# EAGLE board LautIOProto2 (EAGLE 9.6.2), part 1 of 2
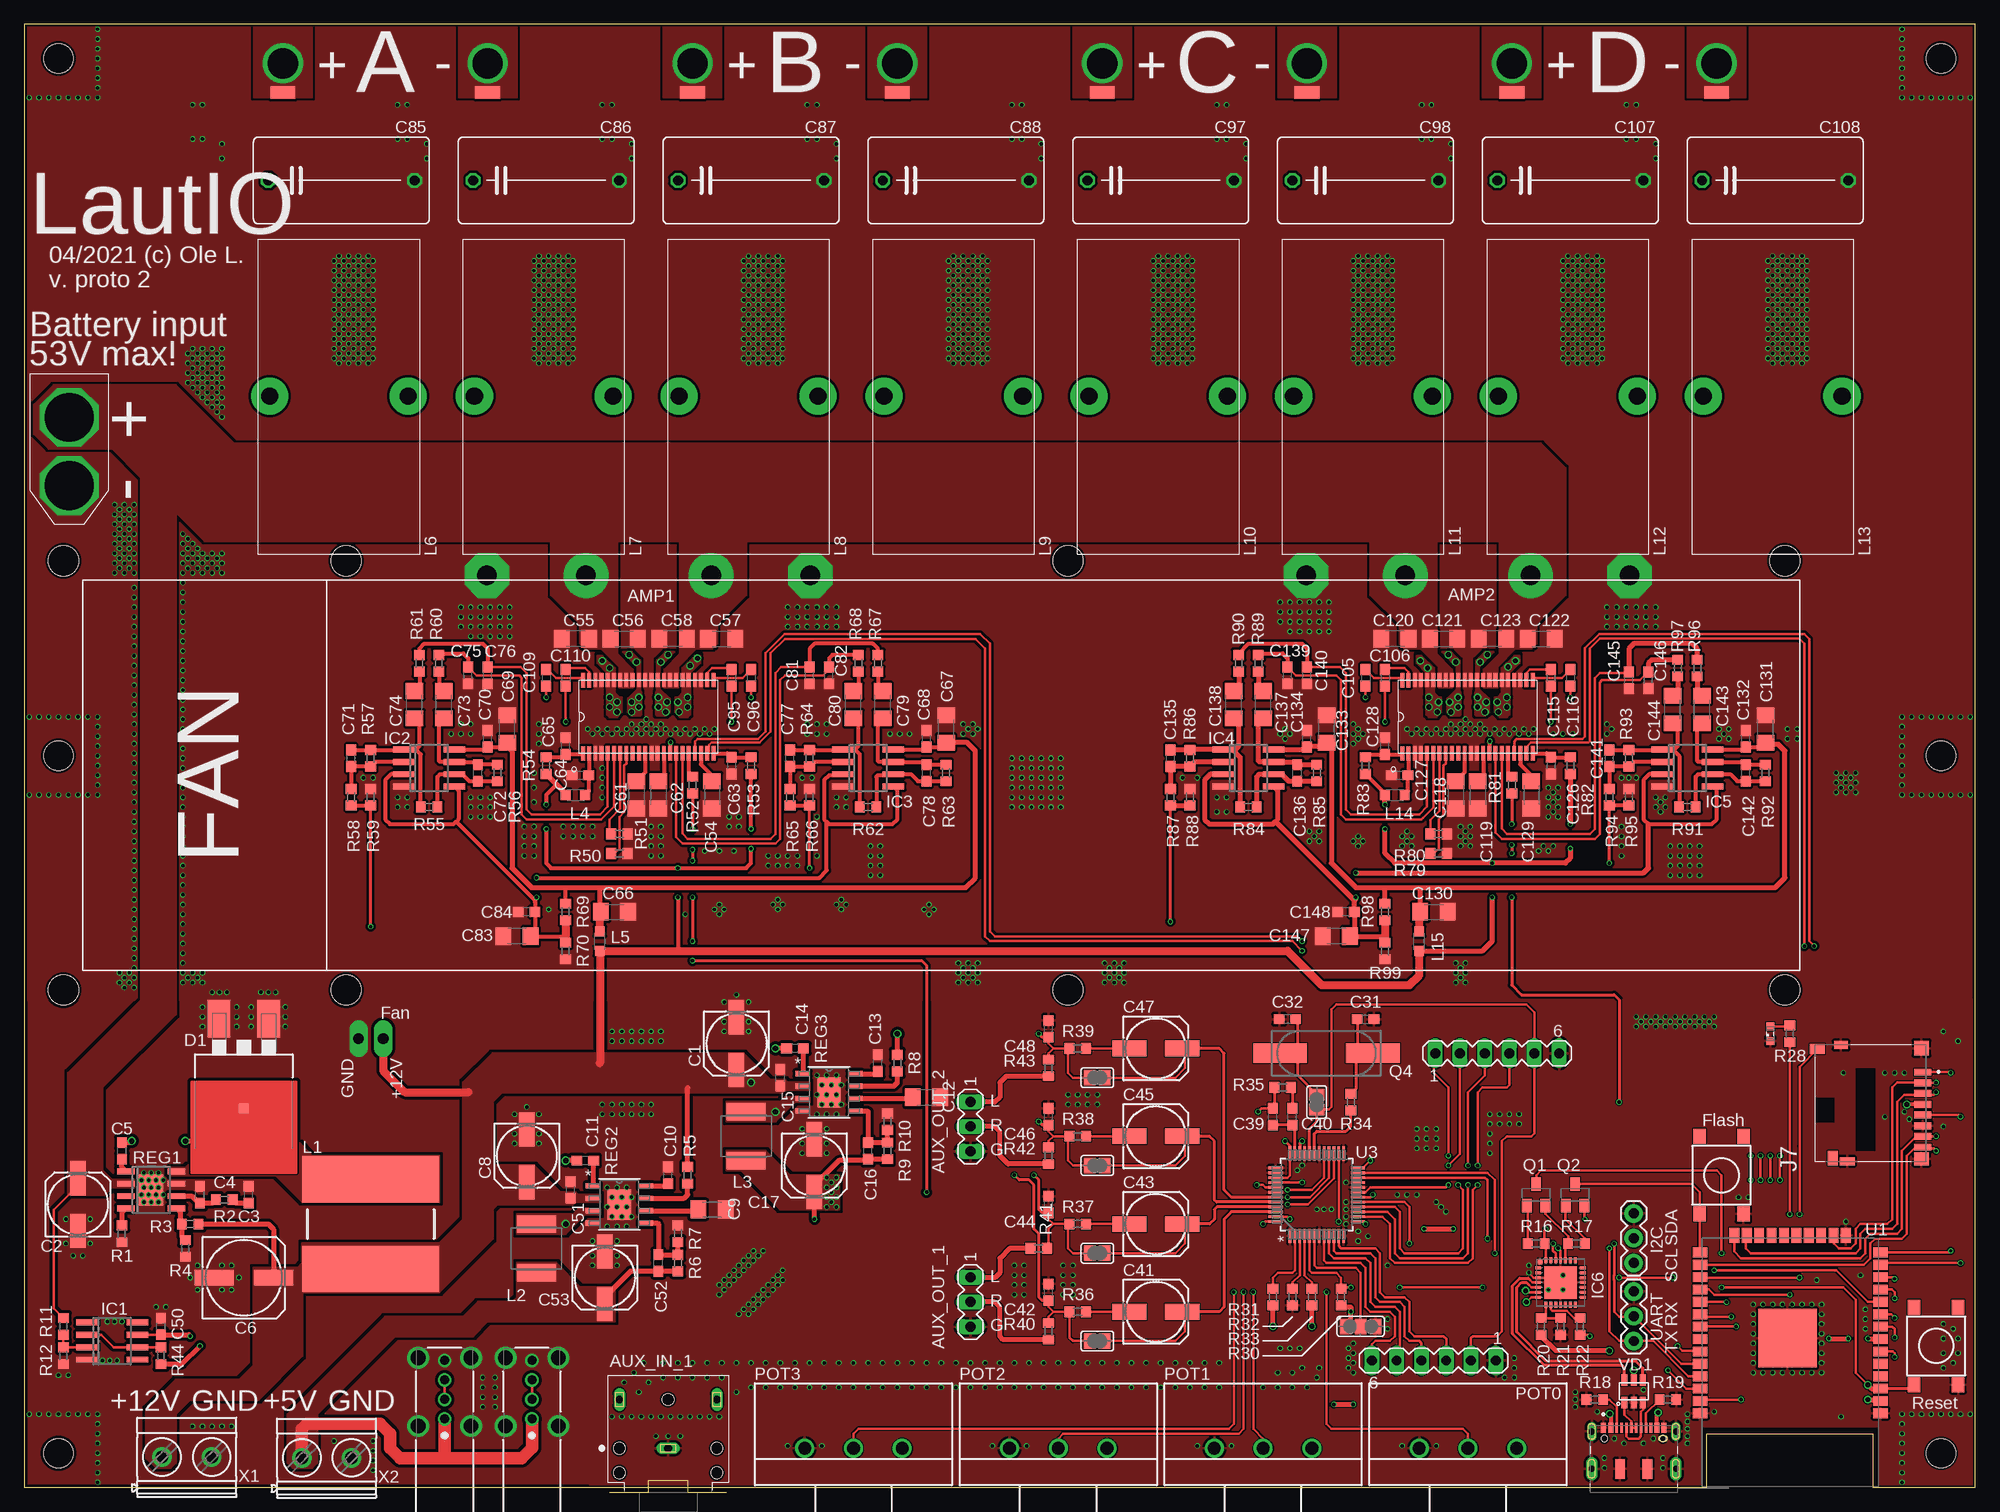
[diagram p8: board, top side]
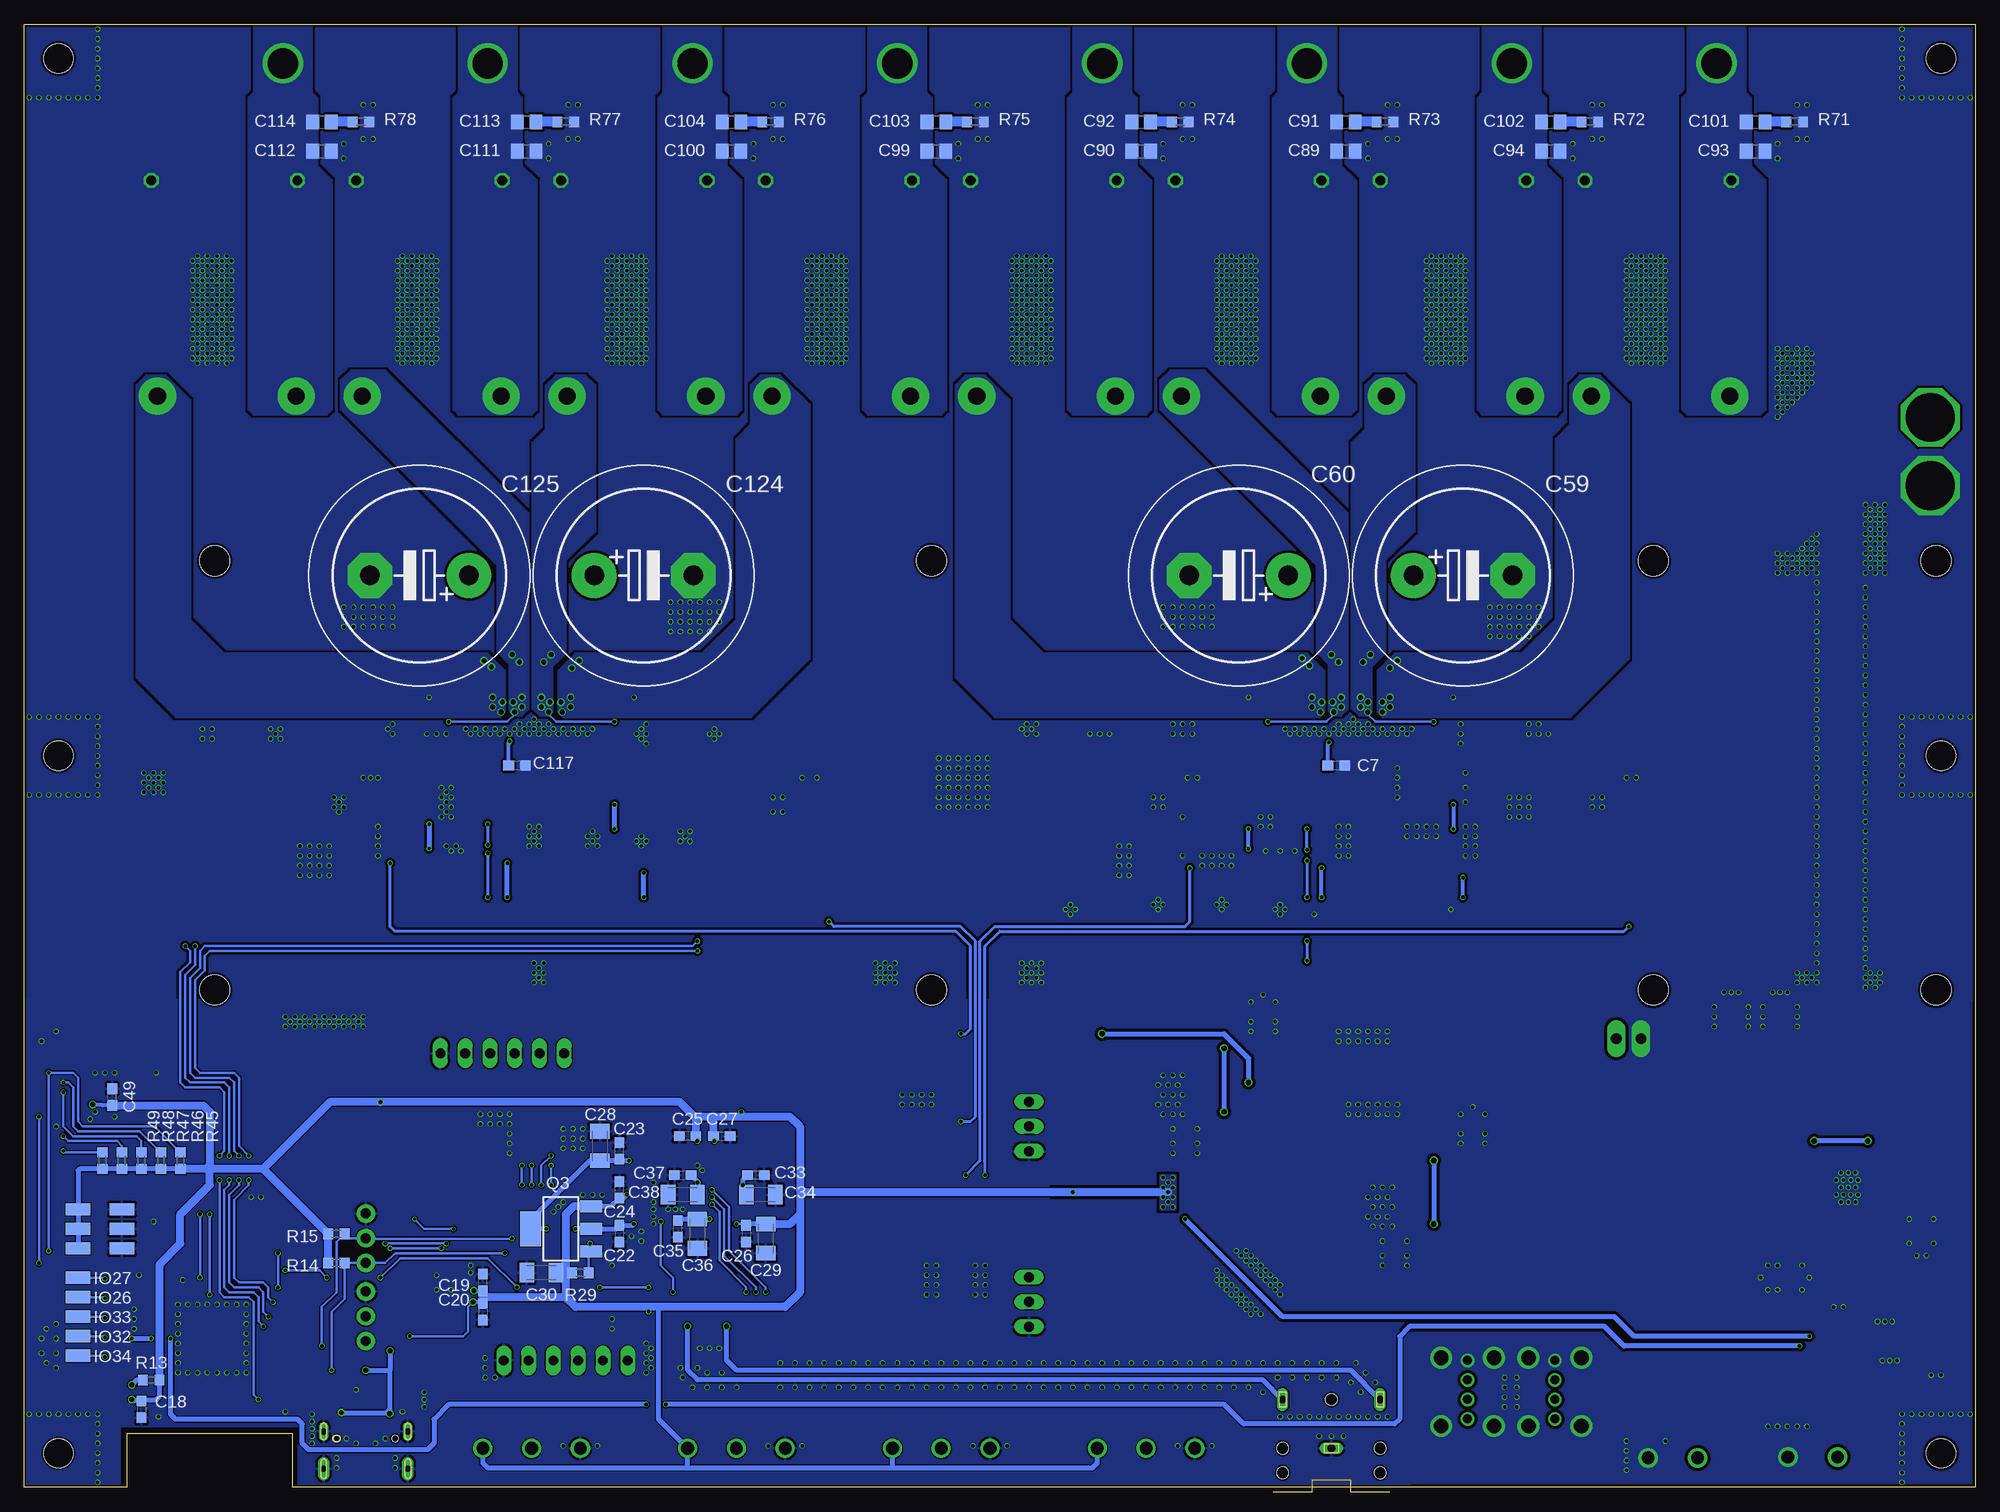
[diagram p9: board, bottom side, seen from below]

Size 200 x 150 mm. Coordinates in mm from the lower left corner, seen from the top.
Outline: 0,0 172.5,0 172.5,5.5 189.5,5.5 189.5,0 200,0 200,150 0,150 0,0
Copper layers (1*16): Top 0.035559375mm / dielectric 1.6mm / Bottom 0.035559375mm
Design rules "jlcpcb2layer *": minimum track width 5mil, minimum drill 12mil, track to track 5mil, track to pad 5mil, pad to pad 5mil, via to via 5mil, smd to smd 5mil, copper to edge 8mil, drill to drill 6mil, minimum pad ring 5mil, minimum via ring 3mil, stop-mask expansion 2.5mil, vias tented up to drill 0mil, thermal gap 10mil
Holes 3 mm at 196.5,3.5 196.5,146.5 3.5,146.5 3.5,3.5 196.5,75 3.5,75
Holes 3.1 mm at 4,95 180.5,95 180.5,51 4,51 107,95 107,51 33,51 33,95

## Footprints (pad centres in the part's own frame; a part is rotated, then mirrored left to right if it is on the bottom)
SMD1,27-2,54 = smd 1.27 x 2.54: 1 0,0
HTSSOP44 = smd 1.45 x 0.4: P$1 -3.75,-0.4; P$2 -3.75,-1.035; P$3 -3.74,-1.67; P$4 -3.74,-2.305; P$5 -3.74,-2.94; P$6 -3.74,-3.575; P$7 -3.74,-4.21; P$8 -3.74,-4.845; P$9 -3.74,-5.48; P$10 -3.74,-6.15; P$11 -3.74,-6.785; P$12 -3.74,-7.42; P$13 -3.74,-8.055; P$14 -3.74,-8.69; P$15 -3.74,-9.325; P$16 -3.74,-9.96; P$17 -3.74,-10.595; P$18 -3.74,-11.23; P$19 -3.74,-11.865; P$20 -3.74,-12.5; P$21 -3.74,-13.135; P$22 -3.74,-13.77; P$23 3.76,-13.77; P$24 3.76,-13.135; P$25 3.76,-12.5; P$26 3.76,-11.865; P$27 3.76,-11.23; P$28 3.76,-10.595; P$29 3.76,-9.96; P$30 3.76,-9.325; P$31 3.76,-8.69; P$32 3.76,-8.055; P$33 3.76,-7.42; P$34 3.76,-6.785; P$35 3.76,-6.15; P$36 3.76,-5.48; P$37 3.76,-4.845; P$38 3.76,-4.21; P$39 3.76,-3.575; P$40 3.76,-2.94; P$41 3.76,-2.305; P$42 3.76,-1.67; P$43 3.75,-1.035; P$44 3.75,-0.4
CUI_SJ1-3523N = drill 0.8 long: 1 0,0; 2 5,-5; 3 5,5 | hole 1.2: -2.5,5; 0,5; 5,0; -2.5,-5; 0,-5
MA03-1 = drill 1.016 long: 1 -2.54,0; 2 0,0; 3 2.54,0
153CLV-0605 = smd 3.5 x 1.6: + 2.7,0; - -2.7,0
C0603 = smd 1.1 x 1: 1 -0.85,0; 2 0.85,0
153CLV-0807 = smd 4 x 1.6: + 3.05,0; - -3.05,0
C3216 = smd 1.6 x 1.8: 1 -1.4,0; 2 1.4,0
C1206K = smd 1.5 x 2: 1 -1.5,0; 2 1.5,0
EB22,5D = drill 2.007 pad 4.597: + -5.08,0 | drill 2.007 pad 4.597 octagon: - 5.08,0
C150-091X182 = drill 1.016 octagon: 1 -7.493,0; 2 7.493,0
C0805 = smd 1.3 x 1.5: 1 -0.95,0; 2 0.95,0
MA06-1 = drill 1.016 long: 1 -6.35,0; 2 -3.81,0; 3 -1.27,0; 4 1.27,0; 5 3.81,0; 6 6.35,0
TO-263/D2PAK = smd 2.32 x 3.81: 1 -2.54,-7.045; 3 2.54,-7.045 | smd 1 x 1: 2 0,2.125
SO08 = smd 0.6 x 2.2: 1 -1.905,-2.6; 2 -0.635,-2.6; 3 0.635,-2.6; 4 1.905,-2.6; 5 1.905,2.6; 6 0.635,2.6; 7 -0.635,2.6; 8 -1.905,2.6
MLP28 = smd 0.6 x 0.3: 1 -2.3,1.5; 2 -2.3,1; 3 -2.3,0.5; 4 -2.3,0; 5 -2.3,-0.5; 6 -2.3,-1; 7 -2.3,-1.5; 15 2.3,-1.5; 16 2.3,-1; 17 2.3,-0.5; 18 2.3,0; 19 2.3,0.5; 20 2.3,1; 21 2.3,1.5 | smd 0.3 x 0.6: 8 -1.5,-2.3; 9 -1,-2.3; 10 -0.5,-2.3; 11 0,-2.3; 12 0.5,-2.3; 13 1,-2.3; 14 1.5,-2.3; 22 1.5,2.3; 23 1,2.3; 24 0.5,2.3; 25 0,2.3; 26 -0.5,2.3; 27 -1,2.3; 28 -1.5,2.3 | smd 3.3 x 3.3: EXP 0,0 | smd 0.435 x 0.435: M -2.103,2.103
614004134726 = drill 0.92: 1 0,2.41; 2 0,4.41; 3 0,6.41; 4 0,8.41 | drill 1.5: S1 -2.71,8.68; S2 2.71,8.68; S3 2.71,1.68; S4 -2.71,1.68
JAE_DX07S016JA1R1500 = smd 0.52 x 1: 1 -3.1,1.1; 2 -2.35,1.1; 11 2.35,1.1; 12 3.1,1.1 | smd 0.27 x 1: 3 -1.75,1.1; 4 -1.25,1.1; 5 -0.75,1.1; 6 -0.25,1.1; 7 0.25,1.1; 8 0.75,1.1; 9 1.25,1.1; 10 1.75,1.1 | smd 1 x 2: S1 -1.4,-3.1; S2 1.4,-3.1 | drill 0.65 long: S3 -4.32,0.725; S4 4.32,0.725 | drill 0.65 pad 1.2 long: S5 -4.32,-3.1; S6 4.32,-3.1 | hole 0.6: 3,0 | hole 0.63: 3,0; -3,0
1X03 = drill 1.016 pad 1.88: 1 0,0; 2 2.54,0; 3 5.08,0
1X02_LONGPADS = drill 1.118 pad 1.88 long: 1 0,0; 2 2.54,0
AMPHENOL_1140084168 = smd 0.7 x 1.75: 1 3.2,-0.875; 2 2.1,-0.875; 3 1,-0.875; 4 -0.1,-0.875; 5 -1.2,-0.875; 6 -2.3,-0.875; 7 -3.4,-0.875; 8 -4.5,-0.875 | smd 1 x 1.55: 9 5.575,9.925 | smd 1.45 x 1: 10 -5.625,8.35 | smd 1.5 x 1.5: S1 5.65,-0.75 | smd 1.3 x 1.5: S2 -5.7,-0.75 | smd 0.8 x 1.4: S3 5.975,7.5 | smd 0.8 x 1.5: S4 -5.95,6.85
INDUCTOR_SDR1307 = smd 14 x 4.75: P$1 0,4.6; P$2 0,-4.6
L5650M = smd 1.8 x 4: 1 -2.5,0; 2 2.5,0
L2012C = smd 1 x 1: 1 -1,0; 2 1,0
HCTI-10-20.0 = drill 1.75 pad 3.81: P$1 1.143,16.129; P$2 15.367,16.129
SML0603 = smd 0.8 x 0.8: A 0.75,0; C -0.75,0
CIP20C-6MM = drill 1.3 pad 1.93: A -5,0; E 5,0; S 0,0
SOT23-BEC = smd 1 x 1.4: B -0.95,-1.1; C 0,1.1; E 0.95,-1.1
SOT223 = smd 1.219 x 2.235: 1 -2.311,-3.099; 2 0,-3.099; 3 2.311,-3.099 | smd 3.6 x 2.2: 4 0,3.099
CSM-7X-DU = smd 5.5 x 2: 1 -4.75,0; 2 4.75,0
R0603 = smd 1 x 1.1: 1 -0.85,0; 2 0.85,0
HSOP8 = smd 0.6 x 1.8: 1 -1.905,-2.6; 2 -0.635,-2.6; 3 0.635,-2.6; 4 1.905,-2.6; 5 1.905,2.6; 6 0.635,2.6; 7 -0.635,2.6; 8 -1.905,2.6 | smd 3.2 x 2.51: EXP 0,0
DDA8_3P1X2P4_TEX = smd 1.455 x 0.533: 1 -2.721,1.905; 2 -2.721,0.635; 3 -2.721,-0.635; 4 -2.721,-1.905; 5 2.721,-1.905; 6 2.721,-0.635; 7 2.721,0.635; 8 2.721,1.905 | smd 2.4 x 3.1: EPAD 0,0
TACTILE_SWITCH_SMD_6.2MM_TALL = smd 1.55 x 1.3: A1 -3.975,-2.25; A2 3.975,-2.25; B1 -3.975,2.25; B2 3.975,2.25
SJ_2 = smd 1.168 x 1.6: 1 -1.524,0; 2 0,0; 3 1.524,0
SJ = smd 1.168 x 1.6: 1 -0.762,0; 2 0.762,0
ESP-WROOM-32 = smd 1.5 x 1: 1 -9.25,7; 2 -9.25,5.73; 3 -9.25,4.46; 4 -9.25,3.19; 5 -9.25,1.92; 6 -9.25,0.65; 7 -9.25,-0.62; 8 -9.25,-1.89; 9 -9.25,-3.16; 10 -9.25,-4.43; 11 -9.25,-5.7; 12 -9.25,-6.97; 13 -9.25,-8.24; 14 -9.25,-9.51; 25 9.25,-9.51; 26 9.25,-8.24; 27 9.25,-6.97; 28 9.25,-5.7; 29 9.25,-4.43; 30 9.25,-3.16; 31 9.25,-1.89; 32 9.25,-0.62; 33 9.25,0.65; 34 9.25,1.92; 35 9.25,3.19; 36 9.25,4.46; 37 9.25,5.73; 38 9.25,7 | smd 1 x 1.5: 15 -5.7,-11.25; 16 -4.43,-11.25; 17 -3.16,-11.25; 18 -1.89,-11.25; 19 -0.62,-11.25; 20 0.65,-11.25; 21 1.92,-11.25; 22 3.19,-11.25; 23 4.46,-11.25; 24 5.73,-11.25 | smd 6 x 6: GND 0.3,-0.7
ST_48_ADI = smd 1.462 x 0.279: 1 -4.216,2.75; 2 -4.216,2.25; 3 -4.216,1.75; 4 -4.216,1.25; 5 -4.216,0.75; 6 -4.216,0.25; 7 -4.216,-0.25; 8 -4.216,-0.75; 9 -4.216,-1.25; 10 -4.216,-1.75; 11 -4.216,-2.25; 12 -4.216,-2.75; 25 4.216,-2.75; 26 4.216,-2.25; 27 4.216,-1.75; 28 4.216,-1.25; 29 4.216,-0.75; 30 4.216,-0.25; 31 4.216,0.25; 32 4.216,0.75; 33 4.216,1.25; 34 4.216,1.75; 35 4.216,2.25; 36 4.216,2.75 | smd 0.279 x 1.462: 13 -2.75,-4.216; 14 -2.25,-4.216; 15 -1.75,-4.216; 16 -1.25,-4.216; 17 -0.75,-4.216; 18 -0.25,-4.216; 19 0.25,-4.216; 20 0.75,-4.216; 21 1.25,-4.216; 22 1.75,-4.216; 23 2.25,-4.216; 24 2.75,-4.216; 37 2.75,4.216; 38 2.25,4.216; 39 1.75,4.216; 40 1.25,4.216; 41 0.75,4.216; 42 0.25,4.216; 43 -0.25,4.216; 44 -0.75,4.216; 45 -1.25,4.216; 46 -1.75,4.216; 47 -2.25,4.216; 48 -2.75,4.216
XT60 = drill 5 octagon: + 4.5,0; - 11.5,0
SOT-23-6L = smd 0.6 x 1.2: 1 -0.95,-2.3; 2 0,-2.3; 3 0.95,-2.3; 4 0.95,0; 5 0,0; 6 -0.95,0
MKDSN1,5/2-5,08 = drill 1.3 pad 2: 1 -2.561,0.025; 2 2.519,0.025

## Placement (x,y rotation side)
3V3IO  [SMD1,27-2,54]  194.5,24.5 270 bottom
AMP1  TPA3255-Q1  [HTSSOP44]  56.87,79 90 top
AMP2  TPA3255-Q1  [HTSSOP44]  140.87,79 90 top
AUX_IN_1  SJ1-3523N  [CUI_SJ1-3523N]  66,4 90 top
AUX_OUT_1  [MA03-1]  97,19 270 top
AUX_OUT_2  [MA03-1]  97,37 270 top
C1  10µF  [153CLV-0605]  73,45.5 270 top
C2  10µF  [153CLV-0605]  5.5,29 90 top
C3  1.2nF  [C0603]  23,30 90 top
C4  6.8pF  [C0603]  18,30 90 top
C5  100nF  [C0603]  10,34.5 90 top
C6  47µF  [153CLV-0807]  22.5,21.5 0 top
C7  47nF  [C0603]  65.5,74 180 bottom
C8  10µF  [153CLV-0605]  51.5,34 270 top
C9  1µF  [C3216]  70.5,28.5 0 top
C10  8.2nF  [C0603]  66,32 90 top
C11  100nF  [C0603]  57.5,33.5 180 top
C12  1µF  [C3216]  92.5,40 0 top
C13  8.2nF  [C0603]  87.5,43.5 90 top
C14  100nF  [C0603]  79,45 180 top
C15  100nF  [C0603]  77.5,42 90 top
C16  10pF  [C0603]  86.5,34.5 90 top
C17  10µF  [153CLV-0605]  81,33 270 top
C18  100nF  [C0603]  188,8 270 bottom
C19  100nF  [C0603]  153,21 90 bottom
C20  100nF  [C0603]  153,18 270 bottom
C22  100n  [C0603]  139,26 270 bottom
C23  100n  [C0603]  139,34.5 90 bottom
C24  100n  [C0603]  139,30.5 90 bottom
C25  100n  [C0603]  132,36 180 bottom
C26  100n  [C0603]  126,26 270 bottom
C27  100n  [C0603]  128.5,36 0 bottom
C28  10µF  [C1206K]  141,35 90 bottom
C29  10µF  [C1206K]  124,25.5 270 bottom
C30  10µF  [C1206K]  147,22 180 bottom
C31  22pF  [C0603]  137.5,48 0 top
C32  22pF  [C0603]  129.5,48 180 top
C33  100n  [C0603]  125,32 180 bottom
C34  10µF  [C1206K]  124.5,30 180 bottom
C35  100n  [C0603]  133,26.5 90 bottom
C36  10µF  [C1206K]  131,26 90 bottom
C37  100n  [C0603]  132.5,32 0 bottom
C38  47µF  [C1206K]  132.5,30 0 bottom
C39  3.3nF  [C0603]  128,38 90 top
C40  56nF  [C0603]  130,38 90 top
C41  47µF  [153CLV-0605]  116,18 0 top
C42  5.6nF  [C0603]  105,20 90 top
C43  47µF  [153CLV-0605]  116,27 0 top
C44  5.6nF  [C0603]  105,29 90 top
C45  47µF  [153CLV-0605]  116,36 0 top
C46  5.6nF  [C0603]  105,38 90 top
C47  47µF  [153CLV-0605]  116,45 0 top
C48  5.6nF  [C0603]  105,47 90 top
C49  100nF  [C0603]  191,40 90 bottom
C50  100nF  [C0603]  14,16.5 90 top
C51  100nF  [C0603]  56,30.5 90 top
C52  10pF  [C0603]  65,23 90 top
C53  10µF  [153CLV-0605]  59.5,21.5 270 top
C54  1µF  [C3216]  70.5,71 270 top
C55  1µF  [C3216]  56.5,87 180 top
C56  1µF  [C3216]  61.5,87 0 top
C57  1µF  [C3216]  71.5,87 0 top
C58  1µF  [C3216]  66.5,87 180 top
C59  4700µF  [EB22,5D]  52.5,93.5 0 bottom
C60  4700µF  [EB22,5D]  75.5,93.5 180 bottom
C61  1µF  [C3216]  62.75,71 270 top
C62  1µF  [C3216]  65,71 270 top
C63  100nF  [C0603]  72.5,74 270 top
C64  100nF  [C0603]  57,73 180 top
C65  100nF  [C0603]  55.5,76 90 top
C66  1µF  [C3216]  60.5,59 0 top
C67  1µF  [C3216]  94.5,77.75 90 top
C68  100nF  [C0603]  92.5,76.75 90 top
C69  1µF  [C3216]  49.5,77.75 90 top
C70  100nF  [C0603]  47.5,76.75 90 top
C71  22pF  [C0603]  33.5,74.75 90 top
C72  22pF  [C0603]  46.5,73.25 90 top
C73  10µF  [C3216]  43,80.25 90 top
C74  10µF  [C3216]  40,80.25 90 top
C75  100nF  [C0603]  45.5,83.25 90 top
C76  100nF  [C0603]  47.5,83.25 90 top
C77  22pF  [C0603]  78.5,74.75 90 top
C78  22pF  [C0603]  92.5,73.25 90 top
C79  10µF  [C3216]  88,80.25 90 top
C80  10µF  [C3216]  85,80.25 90 top
C81  100nF  [C0603]  80.5,83.25 90 top
C82  100nF  [C0603]  82.5,83.25 90 top
C83  1µF  [C3216]  50.5,56.5 180 top
C84  100nF  [C0603]  51.5,59 180 top
C85  1µF  [C150-091X182]  32.5,134 0 top
C86  1µF  [C150-091X182]  53.5,134 0 top
C87  1µF  [C150-091X182]  74.5,134 0 top
C88  1µF  [C150-091X182]  95.5,134 0 top
C89  1000pF  [C0805]  64.5,137 0 bottom
C90  1000pF  [C0805]  85.5,137 0 bottom
C91  100nF  [C0805]  64.5,140 0 bottom
C92  100nF  [C0805]  85.5,140 0 bottom
C93  1000pF  [C0805]  22.5,137 0 bottom
C94  1000pF  [C0805]  43.5,137 0 bottom
C95  33nF  [C0603]  72.5,83 270 top
C96  33nF  [C0603]  74.5,83 270 top
C97  1µF  [C150-091X182]  116.5,134 0 top
C98  1µF  [C150-091X182]  137.5,134 0 top
C99  1000pF  [C0805]  106.5,137 0 bottom
C100  1000pF  [C0805]  127.5,137 0 bottom
C101  100nF  [C0805]  22.5,140 0 bottom
C102  100nF  [C0805]  43.5,140 0 bottom
C103  100nF  [C0805]  106.5,140 0 bottom
C104  100nF  [C0805]  127.5,140 0 bottom
C105  33nF  [C0603]  137.5,83 270 top
C106  33nF  [C0603]  139.5,83 270 top
C107  1µF  [C150-091X182]  158.5,134 0 top
C108  1µF  [C150-091X182]  179.5,134 0 top
C109  33nF  [C0603]  53.5,83 270 top
C110  33nF  [C0603]  55.5,83 270 top
C111  1000pF  [C0805]  148.5,137 0 bottom
C112  1000pF  [C0805]  169.5,137 0 bottom
C113  100nF  [C0805]  148.5,140 0 bottom
C114  100nF  [C0805]  169.5,140 0 bottom
C115  33nF  [C0603]  156.5,83 270 top
C116  33nF  [C0603]  158.5,83 270 top
C117  47nF  [C0603]  149.5,74 180 bottom
C118  1µF  [C3216]  146.75,71 270 top
C119  1µF  [C3216]  149,71 270 top
C120  1µF  [C3216]  140.5,87 180 top
C121  1µF  [C3216]  145.5,87 0 top
C122  1µF  [C3216]  155.5,87 0 top
C123  1µF  [C3216]  150.5,87 180 top
C124  4700µF  [EB22,5D]  136.5,93.5 0 bottom
C125  4700µF  [EB22,5D]  159.5,93.5 180 bottom
C126  100nF  [C0603]  156.5,74 270 top
C127  100nF  [C0603]  141,73 180 top
C128  100nF  [C0603]  139.5,76 90 top
C129  1µF  [C3216]  154.5,71 270 top
C130  1µF  [C3216]  144.5,59 0 top
C131  1µF  [C3216]  178.5,77.75 90 top
C132  100nF  [C0603]  176.5,76.75 90 top
C133  1µF  [C3216]  133.5,77.75 90 top
C134  100nF  [C0603]  131.5,76.75 90 top
C135  22pF  [C0603]  117.5,74.75 90 top
C136  22pF  [C0603]  130.5,73.25 90 top
C137  10µF  [C3216]  127,80.25 90 top
C138  10µF  [C3216]  124,80.25 90 top
C139  100nF  [C0603]  129.5,83.25 90 top
C140  100nF  [C0603]  131.5,83.25 90 top
C141  22pF  [C0603]  162.5,74.75 90 top
C142  22pF  [C0603]  176.5,73.25 90 top
C143  10µF  [C3216]  172,79.75 90 top
C144  10µF  [C3216]  169,79.75 90 top
C145  100nF  [C0603]  164.5,82.75 90 top
C146  100nF  [C0603]  166.5,82.75 90 top
C147  1µF  [C3216]  134.5,56.5 180 top
C148  100nF  [C0603]  135.5,59 180 top
CHAIN_INPUT  [MA06-1]  144.5,13 180 top
CHAIN_OUTPUT  [MA06-1]  151,44.5 0 top
D1  STPS20M100SG-TR  [TO-263/D2PAK]  22.5,41 180 top
IC1  UA741D  [SO08]  9,15 270 top
IC2  NE5532D  [SO08]  41.5,73.75 270 top
IC3  NE5532D  [SO08]  86.5,73.75 270 top
IC4  NE5532D  [SO08]  125.5,73.75 270 top
IC5  NE5532D  [SO08]  170.5,73.75 270 top
IC6  CP2102  [MLP28]  157.5,21 0 top
IO1  [SMD1,27-2,54]  190,24.5 270 bottom
IO2  [SMD1,27-2,54]  194.5,26.5 270 bottom
IO3  [SMD1,27-2,54]  194.5,28.5 270 bottom
IO4  [SMD1,27-2,54]  190,26.5 270 bottom
IO5  [SMD1,27-2,54]  190,28.5 90 bottom
IO26  [SMD1,27-2,54]  194.5,19.5 90 bottom
IO27  [SMD1,27-2,54]  194.5,21.5 90 bottom
IO32  [SMD1,27-2,54]  194.5,15.5 90 bottom
IO33  [SMD1,27-2,54]  194.5,17.5 90 bottom
IO34  [SMD1,27-2,54]  194.5,13.5 90 bottom
J1  614004134726  [614004134726]  52.04,4.6 0 top
J2  614004134726  [614004134726]  43.09,4.6 0 top
J3  DX07S016JA1R1500  [JAE_DX07S016JA1R1500]  165,5 0 top
J4  455-1750-1-ND  [1X03]  165,15 90 top
J5  455-1750-1-ND  [1X03]  165,23 90 top
J6  [1X02_LONGPADS]  34.25,46 0 top
J7  1140084168  [AMPHENOL_1140084168]  193.75,39.38 90 top
L1  15µH  [INDUCTOR_SDR1307]  35.5,27 0 top
L2  CLF7045T-3R3N  [L5650M]  52.5,24.5 270 top
L3  CLF7045T-3R3N  [L5650M]  74,36 270 top
L4  10µH  [L2012C]  56.5,71 0 top
L5  10µH  [L2012C]  59,56 90 top
L6  HTCI-10-20.0  [HCTI-10-20.0]  40.5,128 180 top
L7  HTCI-10-20.0  [HCTI-10-20.0]  61.5,128 180 top
L8  HTCI-10-20.0  [HCTI-10-20.0]  82.5,128 180 top
L9  HTCI-10-20.0  [HCTI-10-20.0]  103.5,128 180 top
L10  HTCI-10-20.0  [HCTI-10-20.0]  124.5,128 180 top
L11  HTCI-10-20.0  [HCTI-10-20.0]  145.5,128 180 top
L12  HTCI-10-20.0  [HCTI-10-20.0]  166.5,128 180 top
L13  HTCI-10-20.0  [HCTI-10-20.0]  187.5,128 180 top
L14  [L2012C]  140.5,71 0 top
L15  [L2012C]  143,56 90 top
LED_SYS  [SML0603]  179,46.5 90 top
PAD1  [SMD1,27-2,54]  26.5,143 270 top
PAD2  [SMD1,27-2,54]  47.5,143 270 top
PAD3  [SMD1,27-2,54]  89.5,143 270 top
PAD4  [SMD1,27-2,54]  68.5,143 270 top
PAD5  [SMD1,27-2,54]  110.5,143 270 top
PAD6  [SMD1,27-2,54]  131.5,143 270 top
PAD7  [SMD1,27-2,54]  173.5,143 270 top
PAD8  [SMD1,27-2,54]  152.5,143 270 top
POT0  [CIP20C-6MM]  148,4 0 top
POT1  [CIP20C-6MM]  127,4 0 top
POT2  [CIP20C-6MM]  106,4 0 top
POT3  [CIP20C-6MM]  85,4 0 top
Q1  SS8050-G  [SOT23-BEC]  155,30 0 top
Q2  SS8050-G  [SOT23-BEC]  159,30 0 top
Q3  ZX5T953  [SOT223]  145,26.5 90 bottom
Q4  12.288MHz  [CSM-7X-DU]  133.5,44.5 0 top
R1  187kΩ  [R0603]  10,26 90 top
R2  44.2kΩ  [R0603]  20.5,29.5 180 top
R3  147kΩ  [R0603]  17,27 0 top
R4  10.5kΩ  [R0603]  16.5,24.5 90 top
R5  10kΩ  [R0603]  68,32 270 top
R6  133kΩ  [R0603]  67,23 270 top
R7  24kΩ  [R0603]  67,26 270 top
R8  10kΩ  [R0603]  89.5,43.5 270 top
R9  84.5kΩ  [R0603]  88.5,34.5 270 top
R10  25.5kΩ  [R0603]  88.5,37.5 270 top
R11  1MΩ  [R0603]  4,16.5 90 top
R12  66.398kΩ  [R0603]  4,13.5 90 top
R13  10kΩ  [R0603]  187,11 0 bottom
R14  4.7kΩ  [R0603]  168,23 0 bottom
R15  4.7kΩ  [R0603]  168,26 0 bottom
R16  10kΩ  [R0603]  155,25 180 top
R17  10kΩ  [R0603]  159.12,25 0 top
R18  5.1kΩ  [R0603]  161,9 180 top
R19  5.1kΩ  [R0603]  168.5,9 0 top
R20  22.1kΩ  [R0603]  155.5,16.5 90 top
R21  47.5kΩ  [R0603]  157.5,16.5 270 top
R22  2kΩ  [R0603]  159.5,16.5 90 top
R28  47Ω  [R0603]  181,46.5 90 top
R29  1kΩ  [R0603]  143,22 180 bottom
R30  10kΩ  [R0603]  135,19.5 270 top
R31  18kΩ  [R0603]  128,19.5 270 top
R32  18kΩ  [R0603]  130,19.5 270 top
R33  18kΩ  [R0603]  132,19.5 270 top
R34  100Ω  [R0603]  136,39.5 90 top
R35  475Ω  [R0603]  129,41 0 top
R36  560Ω  [R0603]  108,18 0 top
R37  560Ω  [R0603]  108,27 0 top
R38  560Ω  [R0603]  108,36 0 top
R39  560Ω  [R0603]  108,45 0 top
R40  0Ω  [R0603]  105,16 270 top
R41  0Ω  [R0603]  104,24.5 180 top
R42  0Ω  [R0603]  105,34 270 top
R43  0Ω  [R0603]  105,43 270 top
R44  0kΩ  [R0603]  14,13.5 270 top
R45  47kΩ  [R0603]  184,33.5 90 bottom
R46  47kΩ  [R0603]  186,33.5 90 bottom
R47  47kΩ  [R0603]  188,33.5 90 bottom
R48  47kΩ  [R0603]  190,33.5 90 bottom
R49  47kΩ  [R0603]  192,33.5 90 bottom
R50  30kΩ  [R0603]  61,65 180 top
R51  22kΩ  [R0603]  61,67 180 top
R52  10kΩ  [R0603]  68.5,72 90 top
R53  0Ω  [R0603]  74.5,74 90 top
R54  0Ω  [R0603]  53.5,74 90 top
R55  10kΩ  [R0603]  41.5,69.75 0 top
R56  10kΩ  [R0603]  48.5,73.25 90 top
R57  10kΩ  [R0603]  35.5,74.75 90 top
R58  10kΩ  [R0603]  33.5,70.75 90 top
R59  100kΩ  [R0603]  35.5,70.75 270 top
R60  100Ω  [R0603]  42.5,84.5 90 top
R61  100Ω  [R0603]  40.5,84.5 90 top
R62  10kΩ  [R0603]  86.5,69.75 0 top
R63  10kΩ  [R0603]  94.5,73.25 90 top
R64  10kΩ  [R0603]  80.5,74.75 90 top
R65  10kΩ  [R0603]  78.5,70.75 90 top
R66  100kΩ  [R0603]  80.5,70.75 270 top
R67  100Ω  [R0603]  87.5,84.5 90 top
R68  100Ω  [R0603]  85.5,84.5 90 top
R69  10kΩ  [R0603]  55.5,59 270 top
R70  10kΩ  [R0603]  55.5,55 90 top
R71  3.3Ω  [R0603]  18.5,140 0 bottom
R72  3.3Ω  [R0603]  39.5,140 0 bottom
R73  3.3Ω  [R0603]  60.5,140 0 bottom
R74  3.3Ω  [R0603]  81.5,140 0 bottom
R75  3.3Ω  [R0603]  102.5,140 0 bottom
R76  3.3Ω  [R0603]  123.5,140 0 bottom
R77  3.3Ω  [R0603]  144.5,140 0 bottom
R78  3.3Ω  [R0603]  165.5,140 0 bottom
R79  30kΩ  [R0603]  145,65 180 top
R80  22kΩ  [R0603]  145,67 180 top
R81  10kΩ  [R0603]  152.5,72 90 top
R82  0Ω  [R0603]  158.5,74 90 top
R83  0Ω  [R0603]  137.5,74 90 top
R84  10kΩ  [R0603]  125.5,69.75 0 top
R85  10kΩ  [R0603]  132.5,73.25 90 top
R86  10kΩ  [R0603]  119.5,74.75 90 top
R87  10kΩ  [R0603]  117.5,70.75 90 top
R88  100kΩ  [R0603]  119.5,70.75 270 top
R89  100Ω  [R0603]  126.5,84.5 90 top
R90  100Ω  [R0603]  124.5,84.5 90 top
R91  10kΩ  [R0603]  170.5,69.75 0 top
R92  10kΩ  [R0603]  178.5,73.25 90 top
R93  10kΩ  [R0603]  164.5,74.75 90 top
R94  10kΩ  [R0603]  162.5,70.75 90 top
R95  100kΩ  [R0603]  164.5,70.75 270 top
R96  100Ω  [R0603]  171.5,84 90 top
R97  100Ω  [R0603]  169.5,84 90 top
R98  10kΩ  [R0603]  139.5,59 270 top
R99  10kΩ  [R0603]  139.5,55 90 top
REG1  TPS54560B-Q1  [HSOP8]  13,30.5 270 top
REG2  TPS54339DDA  [DDA8_3P1X2P4_TEX]  61,29 0 top
REG3  TPS54339DDA  [DDA8_3P1X2P4_TEX]  82.5,40.5 0 top
S1  MOMENTARY-SWITCH-SPST-SMD-6.2MM-TALL  [TACTILE_SWITCH_SMD_6.2MM_TALL]  196,14.5 270 top
S2  MOMENTARY-SWITCH-SPST-SMD-6.2MM-TALL  [TACTILE_SWITCH_SMD_6.2MM_TALL]  174,32 270 top
SJ1  [SJ_2]  137,16.5 180 top
SJ2  [SJ]  132.5,39.5 270 top
SJ6  [SJ]  110,15 180 top
SJ7  [SJ]  110,24 180 top
SJ8  [SJ]  110,33 180 top
SJ9  [SJ]  110,42 180 top
U1  ESP-WROOM-32  [ESP-WROOM-32]  181.05,14.58 180 top
U3  ADAU1701JSTZ  [ST_48_ADI]  132.5,30 90 top
U$1  XT60  [XT60]  4.59,114.21 270 top
VD1  [SOT-23-6L]  165,11 0 top
X1  MKDSN1,5/2-5,08  [MKDSN1,5/2-5,08]  16.68,3.08 0 top
X2  MKDSN1,5/2-5,08  [MKDSN1,5/2-5,08]  31,3 0 top

## Tracks (layer width: path | path; a pad name or v marks a point on that pad's centre or on a via)
+3V3  (via drill 0.35, 0.5)
  Top 0.254: IC1.7 13.98,15.63 C50.1 | v127,27 127.25,27.25 U3.48 | U3.39 129.5,31.75 129.75,32 U3.36 | R22.1 160.35,15.65 v160.5,15.5 | C39.2 126.85,38.85 v126.5,38.5 | U3.18 138,29.75 v138.25,30 | v153.91,20.16 154.07,20 IC6.6 | v154,19 154.5,19.5 IC6.7
  Top 0.305: R35.1 128.15,39 C39.2 | v129.25,35.5 129.75,35 U3.36 | v131,35.5 130.75,35.25 U3.34 | R52.1 v68.5,67.5 | v68.5,65.38 v68.5,64.25 | v68.5,60.5 v68.5,56 | v68.5,54 92,54 92.5,53.5 v92.5,30.25 | R81.1 v152.5,68 | v152.5,65.88 v152.5,65 | v152.5,60.5 152.5,51.5 153.5,50.5 163,50.5 163.5,50 v163.5,39.5
  Top 0.406: J7.4 193.03,39.27 v193,39.25
  Top 0.508: R9.2 C16.1 86.35,33.5 83.5,33.5 81,31 C17.+ v81,27.5 | v189,9 190.15,9 U1.2 | SJ1.3 135.98,17 135.98,17.98 v136,18 136,18.5 135.15,18.5 R30.2 | C50.1 16.85,15.65 v17,15.5
  Bottom 0.254: C26.1 126.15,27 v127,27 | v160.5,15.5 155,15.5 154.5,16 154.5,18.5 v154,19 | v126.5,38.5 126.5,38 | 152.5,66 v152.5,65.88 | v68.5,65.38 68.5,65.5
  Bottom 0.305: C27.1 129.35,35.6 v129.25,35.5 | C25.1 131.15,35.65 v131,35.5 | 68.5,65.5 v68.5,67.5 | v68.5,64.25 v68.5,60.5 | v68.5,56 v68.5,54 | v152.5,68 152.5,66 | v152.5,65 v152.5,60.5
  Bottom 0.406: v153.91,20.16 153.01,20.16 C19.1 | v154,19 153,19 | v193,39.25 192.1,39.25 192,39.15 C49.1
  Bottom 0.508: C19.1 153,19.5 153,19 C20.1 | v189,9 188.85,8.85 C18.1 187.85,9 186.5,9 186.15,9.35 R13.2 | R45.1 R46.1 R47.1 R48.1 R49.1 194.35,32.65 194.5,32.5 IO3.1 IO2.1 3V3IO.1 | C29.1 125.85,27 C26.1 | v138.25,30 138.6,29.65 C24.1 139.84,28.81 Q3.3 | v136,18 136,18.5 | POT0.E 153,2.5 152.5,2 132,2 | 132,2 POT1.E 135,7 135,18.5 | 132,2 111,2 | 111,2 POT2.E | 111,2 90.5,2 90,2.5 POT3.E | v17,15.5 35,15.5 37,17.5 71,17.5 v81,27.5
  Bottom 0.813: R29.2 144.5,22 | 144.5,22 C30.1 | Q3.3 143.69,28.81 144.5,28 144.5,22 | C49.1 181.65,39.15 181,38.5 181,33 | 181,33 181.35,32.65 | 181.35,32.65 R45.1 | R14.1 R15.1 175.5,32.65 | 175.5,32.65 181.35,32.65 | R13.2 186.15,22.85 184,25 184,28 181,31 181,33 | C27.1 129.35,37.85 129.5,38 | 129.5,38 131,38 131.15,37.85 | C25.1 131.15,37.85 | C29.1 121.5,27 120.5,28 | 120.5,30.5 120.5,37 121.5,38 126.5,38 129.5,38 | 120.5,30.5 120.5,28 | 120.5,28 120.5,20 122,18.5 135,18.5 136,18.5 143.5,18.5 144.5,19.5 | 144.5,22 144.5,19.5 | 131.15,37.85 132.8,39.5 v163.5,39.5 168.65,39.5 175.5,32.65 | 144.5,19.5 153,19.5 | v82.75,30.25 v92.5,30.25 120.25,30.25 120.5,30.5
  other vias: 82.75,31.25 82.75,29.25 82.25,29.75 82.25,30.75 83.25,30.75 82.25,31.75 83.25,31.75 83.25,29.75 83.25,28.75 82.25,28.75
  pour Top (rank 4, no thermals): 72,34.5 72,32.5 73.5,32.5 77.5,28.5 83.5,28.5 83.5,32 78.5,32 76,34.5
  pour Bottom (rank 4, no thermals): 83.5,32 82,32 82,28.5 83.5,28.5
+5V
  Top 0.508: R6.2 C52.1 62.15,22.15 59.5,19.5 C53.+
  Top 1.27: X2.1 28.44,5.94 29,6.5 36.5,6.5 37.5,5.5 37.5,4 38.5,3 43,3 | J1.1 52.04,4.04 51,3 43,3 | J2.1 43.09,3.09 43,3
  pour Top (rank 4, no thermals): 50.5,23 54.5,23 57,20.5 60.5,20.5 60.5,17 50.5,17
  pour Top (rank 4, no thermals): 50.5,17 47.5,17 46,15.5 38,15.5 30,7.5 30,2.5 29.5,2 27.5,2 27,2.5 27,7.5 37,17.5 45,17.5 46.5,19 50,19 50.5,19.5
+12V  (via drill 0.35, 0.55)
  Top 0.406: 54.58,72.08 53.5,71 v53.5,70 | v53.5,67.5 53.5,64 54,63.5 v67,63.5 74,63.5 74.5,64 v74.5,65.48 | v74.5,67.5 R53.1 | v67,60.5 67,55 | R83.1 139.5,71.15 L14.1
  Top 0.508: R3.2 25,27 25.55,26.45 C6.+ | R8.1 v89.5,46.5 | R5.1 68,41 | R54.1 54.58,72.08 55.5,71.15 L4.1 | R82.1 v158.5,68 | v158.5,65.5 158.5,64.5 158,64 v150.5,64 140.5,64 139.5,65 v139.5,67.5 | v139.5,70 L14.1 | L15.1 149.5,55 150.5,56 v150.5,60.5
  Top 0.813: 59,43.5 L5.1 67,55 129.5,55 133,51.5 142,51.5 143,52.5 L15.1 | J6.2 36.79,42.71 39,40.5 45.5,40.5
  Bottom 0.406: v53.5,70 v53.5,67.5 | v74.5,65.48 v74.5,67.5 | v67,60.5 v67,63.5
  Bottom 0.508: v89.5,46.5 77,46.5 74.5,44 v74.5,41.5 | v158.5,68 v158.5,65.5 | v139.5,67.5 v139.5,70 | v150.5,60.5 v150.5,64
  pour Top (rank 4, no thermals): 42.5,25 42.5,20 28.5,20 28,20.5 23.5,20.5 23.5,22.5 27.5,22.5 28,22.5 28.5,23 28.5,25
  pour Top (rank 4, no thermals): 59,30 59,29.25 56.5,29.25 56.25,29 50.75,29 50.75,33 52.25,33 55,30.25 56.5,30.25 56.75,30
  pour Top (rank 4, no thermals): 80.5,41.5 80.5,40.75 78,40.75 77.75,40.5 72.25,40.5 72.25,44.5 73.75,44.5 76.5,41.75 78,41.75 78.25,41.5
  pour Top (rank 4, no thermals): 12.5,3 13.5,2 15,2 15.5,2.5 15.5,7.5 17,9 24,9 28.5,13.5 28.5,20 28,20.5 23.5,20.5 23.5,12.5 22,11 15.5,11 12.5,8
  pour Top (rank 4, no thermals): 42.5,20 48,25.5 48,28.5 48.5,29 50.75,29 50.75,33 45,33 45,27.5 42.5,25
  pour Top (rank 4, no thermals): 45,33 45,41.5 48,44.5 72.25,44.5 72.25,40.5 49,40.5 48,39.5 48,33
+12VOA
  Top 0.406: IC3.8 92.25,75.66 C68.1 93.9,75.9 94.35,76.35 C67.1 | IC2.8 47.26,75.66 | C70.1 49.05,75.9 | 58.9,59 59,58.9 | R69.1 55.5,61.5
  Top 0.508: 47.26,75.66 C70.1 | 49.05,75.9 C69.1 49.5,76 50,75.5 50,63.5 52,61.5 55.5,61.5 59,61.5 | C66.1 59,59 59,61.5 | C67.1 96.65,76.35 97.5,75.5 97.5,62.5 96.5,61.5 59,61.5
  Top 0.813: L5.2 59,58.9 C66.1
+12VOA1
  Top 0.406: IC5.8 176.25,75.66 C132.1 178.05,75.9 178.32,76.17 C131.1
  Top 0.508: IC4.8 131.25,75.66 C134.1 131.6,76 133.5,76 C133.1 134,75.85 134,64 136.5,61.5 139.5,61.5 | R98.1 139.5,61.5 | 139.5,61.5 143,61.5 | 143,61.5 143.1,61.4 C130.1 | 178.32,76.17 179.82,76.17 180.5,75.5 180.5,62.5 179.5,61.5 143,61.5
  Top 0.813: C130.1 143,58.9 L15.2
A_LINE_A  (via drill 0.35)
  Top 0.254: SJ6.2 107.5,15 107.15,15.35 R36.1 105.5,18 | 105.5,18 105,18.5 C42.1 | 105.5,18 105,17.5 R40.1
  Top 0.305: C42.1 104.35,19.15 104,19.5 104,26 103.5,26.5 103.5,31 103,31.5 102,31.5 v101.5,32 | v35.5,57.5 R59.2
  Top 0.406: R58.1 R59.2
  Bottom 0.305: v101.5,32 101.5,55.5 100,57 36,57 v35.5,57.5
A_LINE_B  (via drill 0.35)
  Top 0.254: SJ7.2 107.5,24 107,24.5 107,26.85 R37.1 105.5,27 | 105.5,27 105,27.5 C44.1 | 105.5,27 105,26.5 105,24.65 R41.1
  Top 0.305: C44.1 104.35,28.15 104,28.5 104,31.5 v103.5,32 | v80.5,63.5 R66.2
  Top 0.406: R65.1 R66.2
  Bottom 0.305: v103.5,32 102,33.5 102,56 100.5,57.5 81,57.5 80.5,58 v80.5,63.5
A_LINE_C  (via drill 0.35)
  Top 0.254: SJ8.2 107.5,33 107,33.5 107,35.85 R38.1 105.5,36 | 105.5,36 105,35.5 R42.1 | C46.1 105,36.5 105.5,36
  Top 0.305: C46.1 104.35,37.15 v104,37.5 | v117.5,58 R87.1
  Top 0.508: R87.1 R88.2
  Bottom 0.305: v104,37.5 103,37.5 102.5,38 102.5,56 104,57.5 117,57.5 v117.5,58
A_LINE_D  (via drill 0.35)
  Top 0.254: SJ9.2 107.5,42 107,42.5 107,44.85 R39.1 105.5,45 | 105.5,45 105,44.5 R43.1 | C48.1 105,45.5 105.5,45
  Top 0.305: C48.1 104.35,46.15 v104,46.5 | v162.5,64 R94.1
  Top 0.406: R95.2 R94.1
  Bottom 0.305: v104,46.5 103.5,46.5 103,47 103,55.5 104.5,57 162,57 162.5,57.5 v162.5,64
AMP1_BST_A
  Top 0.254: C109.1 53.65,83.85 54.5,83 57.02,83 AMP1.P$44
AMP1_BST_B
  Top 0.254: AMP1.P$43 57.91,83.59 57.5,84 55.65,84 C110.1
AMP1_BST_C
  Top 0.254: AMP1.P$24 70.01,83.51 70.5,84 72.35,84 C95.1
AMP1_BST_D
  Top 0.254: AMP1.P$23 70.88,83 73.65,83 C96.1
AMP1_CLIP_OTW  (via drill 0.35)
  Top 0.254: AMP1.P$21 70.19,75.44 70.19,76.09 70.45,76.35 75.39,76.35 76.52,77.48 76.52,85.52 78,87 97.5,87 98.5,86 98.5,56.5 99,56 130,56 v131,55 | v177,34 v177,31.5 | v174.5,18.98 174.48,19 173,19 172.99,19.01 U1.29
  Bottom 0.254: v131,55 181,55 181.5,54.5 181.5,53 182.5,52 182.5,43 182,42.5 178.5,42.5 178,42 178,35 v177,34 | v177,31.5 177,31 178.5,29.5 178.5,21.5 178,21 175.5,21 175,20.5 175,19.48 v174.5,18.98
AMP1_FAULT  (via drill 0.35)
  Top 0.254: AMP1.P$19 68.74,76.49 69,76.75 69.02,76.75 69.04,76.73 75.23,76.73 76,77.5 76,85.54 77.96,87.5 98,87.5 99,86.5 99,57 99.5,56.5 130.5,56.5 v131,56 | v178,34 v178,31.5 | U1.30 172.04,17.5 v175,17.5
  Bottom 0.254: v131,56 131.5,55.5 181.5,55.5 182,55 182,53.25 183,52.25 183,42.5 182.5,42 179,42 178.5,41.5 178.5,34.5 v178,34 | v178,31.5 178,31 179,30 179,21 178.5,20.5 176,20.5 175.5,20 175.5,18 v175,17.5
AMP1_IN_A
  Top 0.254: C76.2 50.9,84.1 51.5,83.5 51.5,69.5 52,69 59,69 59.81,69.81 AMP1.P$5
  Top 0.406: R61.2 40.5,86 41,86.5 47,86.5 47.5,86 C76.2
AMP1_IN_B
  Top 0.254: C75.2 46.35,83.25 50.75,83.25 51,83 51,69 51.5,68.5 59.12,68.5 60.45,69.82 AMP1.P$6
  Top 0.406: R60.2 42.65,85.5 45,85.5 45.5,85 C75.2
AMP1_IN_C
  Top 0.254: AMP1.P$16 66.83,66.67 67.5,66 77,66 77.5,66.5 77.5,82.75 78,83.25 81.88,83.25 82.5,83.88 C82.2
  Top 0.406: R68.2 82.85,85.35 82.5,85 C82.2
AMP1_IN_D
  Top 0.254: AMP1.P$17 67.47,67.03 68,66.5 76.5,66.5 77,67 77,83.5 77.6,84.1 C81.2
  Top 0.406: R67.2 87.5,86 87,86.5 81,86.5 80.5,86 C81.2
AMP1_PWM_A  (via drill 0.35, 0.5)
  Top 0.254: C109.2 v53.5,81
  other vias: 60,81 60.75,80.5 60.75,79.5 60,80 60,84 59.25,84.75
  pour Top (rank 4, no thermals): 58.75,85.25 58.75,84.5 59.75,83.5 59.75,79.25 60,79 60.75,79 61.25,79.5 61.25,81 61,81 60.5,81.5 60.5,84 59.25,85.25
  pour Bottom (rank 4, no thermals): 46.5,85.5 59.5,85.5 61.25,83.75 61.25,79.5 60.75,79 41.5,79 35.5,85 35.5,111 38.5,114 40.5,114 41.5,113 41.5,109 43,107.5 43,89
AMP1_PWM_B  (via drill 0.35, 0.5)
  Top 0.254: 62.25,79.25 v62.25,79.5 | C110.2 v55.5,78.5
  Bottom 0.254: v55.5,78.5 61.5,78.5 62.25,79.25 v62.25,79.5
  other vias: 63,81 62.25,80.5 63,80 62.75,84.62 62,85.38
  pour Top (rank 4, no thermals): 62.25,85.62 61.38,85.62 62.88,84.12 62.88,81.88 61.88,80.88 61.88,79.5 62.25,79.12 63.12,79.12 63.25,79.25 63.25,81.5 63.12,81.62 63.12,84.75
  pour Bottom (rank 4, no thermals): 61.88,84.12 61.88,79.5 62.25,79.12 63.12,79.12 63.88,79.88 63.88,107.12 62.5,108.5 62.5,113 61.5,114 58.5,114 57.5,113 57.5,98 60.5,95 60.5,85.5
AMP1_PWM_C  (via drill 0.35, 0.5)
  Top 0.254: 65.75,79.25 v65.75,79.5 | C95.2 v72.5,78.5
  Bottom 0.254: v72.5,78.5 66.5,78.5 65.75,79.25 v65.75,79.5
  other vias: 65,81 65.88,80.5 65,80 65.25,84.62 66,85.38
  pour Bottom (rank 4, no thermals): 64.38,99.88 64.38,79.75 65,79.12 65.75,79.12 66.25,79.62 66.25,84.38 67.5,85.62 67.5,94.5 83.5,110.5 83.5,113.5 82.5,114.5 79,114.5
  pour Top (rank 4, no thermals): 64.75,81.5 64.75,79.25 64.88,79.12 65.75,79.12 66.12,79.5 66.12,80.88 65.12,81.88 65.12,84.12 66.62,85.62 65.75,85.62 64.88,84.75 64.88,81.62
AMP1_PWM_D  (via drill 0.35, 0.5)
  Top 0.254: C96.2 v74.5,81
  other vias: 69,85 67,80.5 68,80 67.12,79.5 68.25,84.25 68,81
  pour Top (rank 4, no thermals): 66.75,81 66.75,79.5 67.25,79 68,79 68.25,79.25 68.25,83.5 69.25,84.5 69.25,85.25 68.75,85.25 67.5,84 67.5,81.5 67,81
  pour Bottom (rank 4, no thermals): 68.5,85.5 66.75,83.75 66.75,79.5 67.25,79 100.5,79 104.5,83 104.5,113 103.5,114 101.5,114 99,111.5 99,89 95.5,85.5
AMP2_BST_A
  Top 0.254: C105.1 138.35,83 141.02,83 AMP2.P$44
AMP2_BST_B
  Top 0.254: C106.1 139.65,84 141.5,84 141.91,83.59 AMP2.P$43
AMP2_BST_C
  Top 0.254: C115.1 154.35,83.85 154,83.5 AMP2.P$24
AMP2_BST_D
  Top 0.254: AMP2.P$23 154.88,83 157.65,83 C116.1
AMP2_CLIP_OTW  (via drill 0.35)
  Top 0.254: AMP2.P$21 154.01,75.91 154.45,76.35 160.35,76.35 160.5,76.5 160.5,86 161.51,87.01 181.99,87.01 182.5,86.5 v182.5,55.5 | v179,34 v179,31.5 | U1.31 171.83,16.5 v175.5,16.5
  Bottom 0.254: v182.5,55.5 182.5,53.54 183.5,52.54 183.5,42 183,41.5 179.5,41.5 179,41 v179,34 | v179,31.5 179,31 179.5,30.5 179.5,20.5 179,20 176.5,20 176,19.5 176,17 v175.5,16.5
AMP2_FAULT  (via drill 0.35)
  Top 0.254: AMP2.P$19 152.74,76.49 152.98,76.73 159.73,76.73 160,77 160,86.04 161.46,87.5 182.5,87.5 183,87 183,56 v183.5,55.5 | v180,34 v180,31.5 | U1.37 171.95,9 v176,9
  Bottom 0.254: v183.5,55.5 183,55 183,53.83 184,52.83 184,41.5 183.5,41 180,41 179.5,40.5 179.5,34.5 v180,34 | v176,9 176.5,9.5 176.5,19 177,19.5 179.5,19.5 180,20 v180,31.5
AMP2_IN_A
  Top 0.254: AMP2.P$5 143.81,69.81 143,69 136,69 135.5,69.5 135.5,83.5 134.9,84.1 C140.2
  Top 0.406: R90.2 124.5,85.5 125.5,86.5 131,86.5 131.5,86 C140.2
AMP2_IN_B
  Top 0.254: AMP2.P$6 144.45,69.7 143.38,68.62 143.25,68.5 135.5,68.5 135,69 135,82.75 134.5,83.25 130.35,83.25 C139.2
  Top 0.406: R89.2 126.65,85.5 129,85.5 129.5,85 C139.2
AMP2_IN_C
  Top 0.254: C146.2 165.65,82.75 161.75,82.75 161.5,82.5 161.5,67 161,66.5 151.5,66.5 150.83,67.17 AMP2.P$16
  Top 0.508: R97.2 166.85,84.85 166.5,84.5 C146.2
AMP2_IN_D
  Top 0.254: C145.2 164.4,83.5 161.5,83.5 161,83 161,67.5 160.5,67 152,67 151.47,67.53 AMP2.P$17
  Top 0.508: R96.2 171.5,86 171,86.5 165,86.5 164.5,86 C145.2
AMP2_PWM_A  (via drill 0.35, 0.5)
  Top 0.254: C105.2 v137.5,81
  other vias: 143.12,84.75 143.88,84 144,81 145,80.5 144,80 144.88,79.5
  pour Top (rank 4, no thermals): 142.75,85.25 142.75,84.5 143.75,83.5 143.75,79.25 144,79 144.75,79 145.25,79.5 145.25,81 145,81 144.5,81.5 144.5,84 143.25,85.25
  pour Bottom (rank 4, no thermals): 130.5,85.5 143.5,85.5 145.25,83.75 145.25,79.5 144.75,79 125.5,79 119.5,85 119.5,111 122.5,114 124.5,114 125.5,113 125.5,109 127,107.5 127,89
AMP2_PWM_B  (via drill 0.35, 0.5)
  Top 0.254: C106.2 v139.5,78.5
  Bottom 0.254: v139.5,78.5 145.5,78.5 146.25,79.25 v146.25,79.5
  other vias: 146,85.38 146.75,84.62 147,81 146.12,80.5 147,80
  pour Top (rank 4, no thermals): 146.25,85.62 145.38,85.62 146.88,84.12 146.88,81.88 145.88,80.88 145.88,79.5 146.25,79.12 147.12,79.12 147.25,79.25 147.25,81.5 147.12,81.62 147.12,84.75
  pour Bottom (rank 4, no thermals): 145.88,84.12 145.88,79.5 146.25,79.12 147.12,79.12 147.88,79.88 147.88,107.12 146.5,108.5 146.5,113 145.5,114 142.5,114 141.5,113 141.5,98 144.5,95 144.5,85.5
AMP2_PWM_C  (via drill 0.35, 0.5)
  Top 0.254: C115.2 v156.5,78.5
  Bottom 0.254: v156.5,78.5 150.5,78.5 149.75,79.25 v149.75,79.5
  other vias: 150,85.38 149.25,84.62 149,81 149.88,80.5 149,80
  pour Top (rank 4, no thermals): 148.75,81.5 148.75,79.25 148.88,79.12 149.75,79.12 150.12,79.5 150.12,80.88 149.12,81.88 149.12,84.12 150.62,85.62 149.75,85.62 148.88,84.75 148.88,81.62
  pour Bottom (rank 4, no thermals): 148.38,99.88 148.38,79.75 149,79.12 149.75,79.12 150.25,79.62 150.25,84.38 151.5,85.62 151.5,94.5 167.5,110.5 167.5,113.5 166.5,114.5 163,114.5
AMP2_PWM_D  (via drill 0.35, 0.5)
  Top 0.254: C116.2 v158.5,81
  other vias: 152.88,84.75 152.12,84.12 152,81 151,80.5 152,80 151.12,79.5
  pour Top (rank 4, no thermals): 150.75,81 150.75,79.5 151.25,79 152,79 152.25,79.25 152.25,83.5 153.25,84.5 153.25,85.25 152.75,85.25 151.5,84 151.5,81.5 151,81
  pour Bottom (rank 4, no thermals): 152.5,85.5 150.75,83.75 150.75,79.5 151.25,79 184.5,79 188.5,83 188.5,113 187.5,114 185.5,114 183,111.5 183,89 179.5,85.5
AUX_IN_1_L  (via drill 0.5)
  Top 0.508: v132,16.5 R33.2
  Bottom 0.508: AUX_IN_1.2 73,11 131,11 132,12 v132,16.5
AUX_IN_1_R  (via drill 0.5)
  Top 0.508: v128,16.5 R31.2
  Bottom 0.508: AUX_IN_1.3 64,12 127,12 128,13 v128,16.5
AUX_OUT_1_L
  Top 0.508: AUX_OUT_1.1 97.04,21.5 99.5,21.5 100,22 100,23.5 101,24.5 R41.2
AUX_OUT_1_R
  Top 0.508: R40.2 100.35,15.15 100,15.5 100,18.5 99.5,19 AUX_OUT_1.2
AUX_OUT_2_L
  Top 0.508: R43.2 100.65,42.15 100,41.5 100,40 99.5,39.5 97.04,39.5 AUX_OUT_2.1
AUX_OUT_2_R
  Top 0.508: R42.2 100.85,33.15 100,34 100,36.5 99.5,37 AUX_OUT_2.2
CP2102_D_N
  Top 0.254: 154.25,20.75 154.5,20.5 IC6.5
  Top 0.305: VD1.4 165.95,12.21 165.23,12.93 156,12.93 153,15.93 153,20.5 153.5,21 154,21 154.25,20.75
CP2102_D_P
  Top 0.254: 154.36,21.25 154.61,21 IC6.4
  Top 0.305: VD1.6 164.05,12.21 163.76,12.5 155.82,12.5 152.57,15.75 152.57,20.68 153.32,21.43 154.18,21.43 154.36,21.25
CRYSTAL_MCLKI
  Top 0.305: C32.1 130.5,47.85 130.5,45 | SJ2.1 130.5,42.26 130.5,45 | Q4.1 129.25,45 130.5,45
DSP_DVDD  (via drill 0.35)
  Top 0.254: v137.5,27 137.25,27.25 U3.13 | v138,33.5 137.25,32.75 U3.24
  Top 0.508: v143.5,26.5 v146.5,26.5
  Bottom 0.508: v137.5,27 137.65,26.85 C22.1 139.35,26.5 Q3.2 v143.5,26.5 | v146.5,26.5 Q3.4 148.1,27.4 142,33.5 C28.1 139.15,33.5 C23.1 138.85,33.5 v138,33.5
DSP_IN_BCLK
  Top 0.254: U3.9 133.75,24 134.25,23.5 137.5,23.5 138,23 138,19 138.5,18.5 140.5,18.5 141,18 141,13.31 CHAIN_INPUT.5
DSP_IN_LRCLK
  Top 0.254: U3.8 133.25,23.25 133.5,23 137,23 137.5,22.5 137.5,18.5 138,18 140,18 140.5,17.5 140.5,15.5 140,15 138.5,15 138.15,14.65 CHAIN_INPUT.6
DSP_IN_SDATA0
  Top 0.254: U3.10 134.25,24.25 134.5,24 138,24 138.5,23.5 138.5,19.5 139,19 141,19 141.5,18.5 141.5,15.5 142,15 143,15 143.23,14.77 CHAIN_INPUT.4
DSP_IN_SDATA1
  Top 0.254: U3.11 134.75,24.75 135,24.5 138.5,24.5 139,24 139,20 139.5,19.5 141.5,19.5 142,19 142,16 142.5,15.5 145.5,15.5 145.77,15.23 CHAIN_INPUT.3
DSP_MCLKI
  Top 0.254: CHAIN_INPUT.2 148.31,15.31 148.5,15.5 151,15.5 151.5,16 151.5,35.5 152,36 154.5,36 154.81,36.31 CHAIN_OUTPUT.5 154.81,48.69 154,49.5 134.5,49.5 134,49 134,39 133.74,38.74 SJ2.2
  Top 0.305: U3.32 131.75,36.75 132.5,37.5 SJ2.2
DSP_OSCO
  Top 0.305: U3.31 132.25,36.25 132.5,36.5 135.5,36.5 136,37 R34.1
DSP_OUT_BCLK  (via drill 0.35)
  Top 0.254: U3.19 137.5,30.25 138,30.75 145.75,30.75 v146,31 | CHAIN_OUTPUT.2 147.19,34.19 v146,33
  Bottom 0.254: v146,31 v146,33
DSP_OUT_LRCLK  (via drill 0.35)
  Top 0.254: U3.16 140.5,28.75 141,28.25 141,24.5 141.5,24 147,24 147.5,24.5 147.5,30.5 v147,31 | v146,34 146,41 144.5,42.5 144.5,44.35 CHAIN_OUTPUT.1
  Bottom 0.254: v147,31 147,33 v146,34
DSP_OUT_SDATA0  (via drill 0.35)
  Top 0.254: U3.15 139.75,28.25 140.5,27.5 140.5,24 141,23.5 147.5,23.5 148,24 v148,31 | v148,33 148,40.5 149.73,42.23 CHAIN_OUTPUT.3
  Bottom 0.254: v148,31 v148,33
DSP_OUT_SDATA1  (via drill 0.35)
  Top 0.254: U3.14 139.25,27.75 140,27 140,23.5 140.5,23 148,23 148.5,23.5 148.5,30.5 v149,31 | v149,33 149,40.5 149.5,41 152,41 152.27,41.27 CHAIN_OUTPUT.4
  Bottom 0.254: v149,31 v149,33
DSP_RESET  (via drill 0.35)
  Top 0.254: U3.5 131.75,22.25 132,22 134.5,22 135,21.5 135,20.5 | 135,20.5 R30.1 | U1.10 188.99,19.01 185.75,22.25 v173.25,22.25 | v169,21.5 v163.5,21.5 | v149.5,20.5 v141,20.5 | v136,20.5 135,20.5
  Bottom 0.254: v173.25,22.25 169.75,22.25 v169,21.5 | v163.5,21.5 161.5,23.5 152.5,23.5 v149.5,20.5 | v141,20.5 v136,20.5
DSP_SELFBOOT
  Top 0.254: U3.6 132.25,22.75 132.5,22.5 136.5,22.5 137,22 SJ1.2
DSP_VDRIVE  (via drill 0.35)
  Top 0.254: v142,25 142,28.75 141.5,29.25 U3.17
  Bottom 0.254: v142,25 142,24.29 Q3.1 142.15,23.94 R29.1
DSP_VOUT0
  Top 0.254: SJ6.1 118,15 119,16 119,18
  Top 0.305: U3.46 123.75,28.25 123,27.5 123,18.5 122.5,18 119,18 C41.+
DSP_VOUT1
  Top 0.254: SJ7.1 118,24 119,25 119,27
  Top 0.305: U3.45 122.25,28.75 122,28.5 122,27.5 121.5,27 119,27 C43.+
DSP_VOUT2
  Top 0.254: SJ8.1 118,33 119,34 119,36
  Top 0.305: U3.44 122.25,29.25 122,29.5 122,35.5 121.5,36 119,36 C45.+
DSP_VOUT3
  Top 0.254: SJ9.1 118,42 119,43 119,45
  Top 0.305: U3.43 123.75,29.75 123,30.5 123,44.5 122.5,45 119,45 C47.+
ESP_EN  (via drill 0.35, 0.5)
  Top 0.254: Q1.C 155,32 155.5,32.5 173.5,32.5 174,32 v174,24 | v189,10.5 187.75,11.75 187.75,19.25 186.5,20.5 v174,20.5
  Top 0.305: S1.A2 193.35,10.12 U1.3
  Top 0.508: v189,10.5 189.38,10.12 U1.3
  Bottom 0.254: v174,24 v174,20.5
  Bottom 0.508: R13.1 188.5,11 v189,10.5
ESP_IO0
  Top 0.254: U1.25 171.8,27.98 S2.A2 171.75,30.25 170.9,31.1 Q2.C
ESP_IO26  (via drill 0.35)
  Top 0.254: U1.11 191.47,20.28 191.75,20 v191.75,19.38
  Bottom 0.254: v191.75,19.38 191.88,19.5 IO26.1
ESP_IO27  (via drill 0.35)
  Top 0.254: U1.12 191.57,21.55 v191.75,21.38
  Bottom 0.254: v191.75,21.38 191.88,21.5 IO27.1
ESP_IO32  (via drill 0.35)
  Top 0.254: U1.8 191.53,16.47 191.75,16.25 v191.75,15.38
  Bottom 0.254: v191.75,15.38 191.88,15.5 IO32.1
ESP_IO33  (via drill 0.35)
  Top 0.254: U1.9 191.38,17.74 v191.75,17.38
  Bottom 0.254: v191.75,17.38 191.88,17.5 IO33.1
ESP_IO34  (via drill 0.35)
  Top 0.254: U1.6 191.57,13.93 191.75,13.75 v191.75,13.38
  Bottom 0.254: v191.75,13.38 191.88,13.5 IO34.1
ESP_RXD0  (via drill 0.35)
  Top 0.254: J4.2 165.02,17.52 | 165.02,17.52 169.88,12.66 U1.34 | v156.75,24.98 156.75,24.75 156.73,24.73 156.73,24.27 157,24 IC6.26 | v163,24.98 163,24.73 163.02,24.71 163.02,21.75 162.98,21.71 162.98,21.29 163,21.27 163,18 163.5,17.5 165,17.5 165.02,17.52
  Bottom 0.254: v156.75,24.98 156.74,24.98 156.79,25.03 162.95,25.03 v163,24.98
ESP_TXD0  (via drill 0.35)
  Top 0.254: U1.35 170.61,11.39 167,15 J4.1 163.5,15 162.5,16 v162.5,24.5 | v157.25,24.52 157.5,24.27 IC6.25
  Bottom 0.254: v157.25,24.52 157.27,24.5 v162.5,24.5
GND  (via drill 0.35)
  Top 0.254: 154.75,21.5 v154.25,22 | IC6.3 157,21.5 IC6.EXP